# EAGLE board mainboard-01-8x2+1c (EAGLE 9.6.2), part 1 of 2
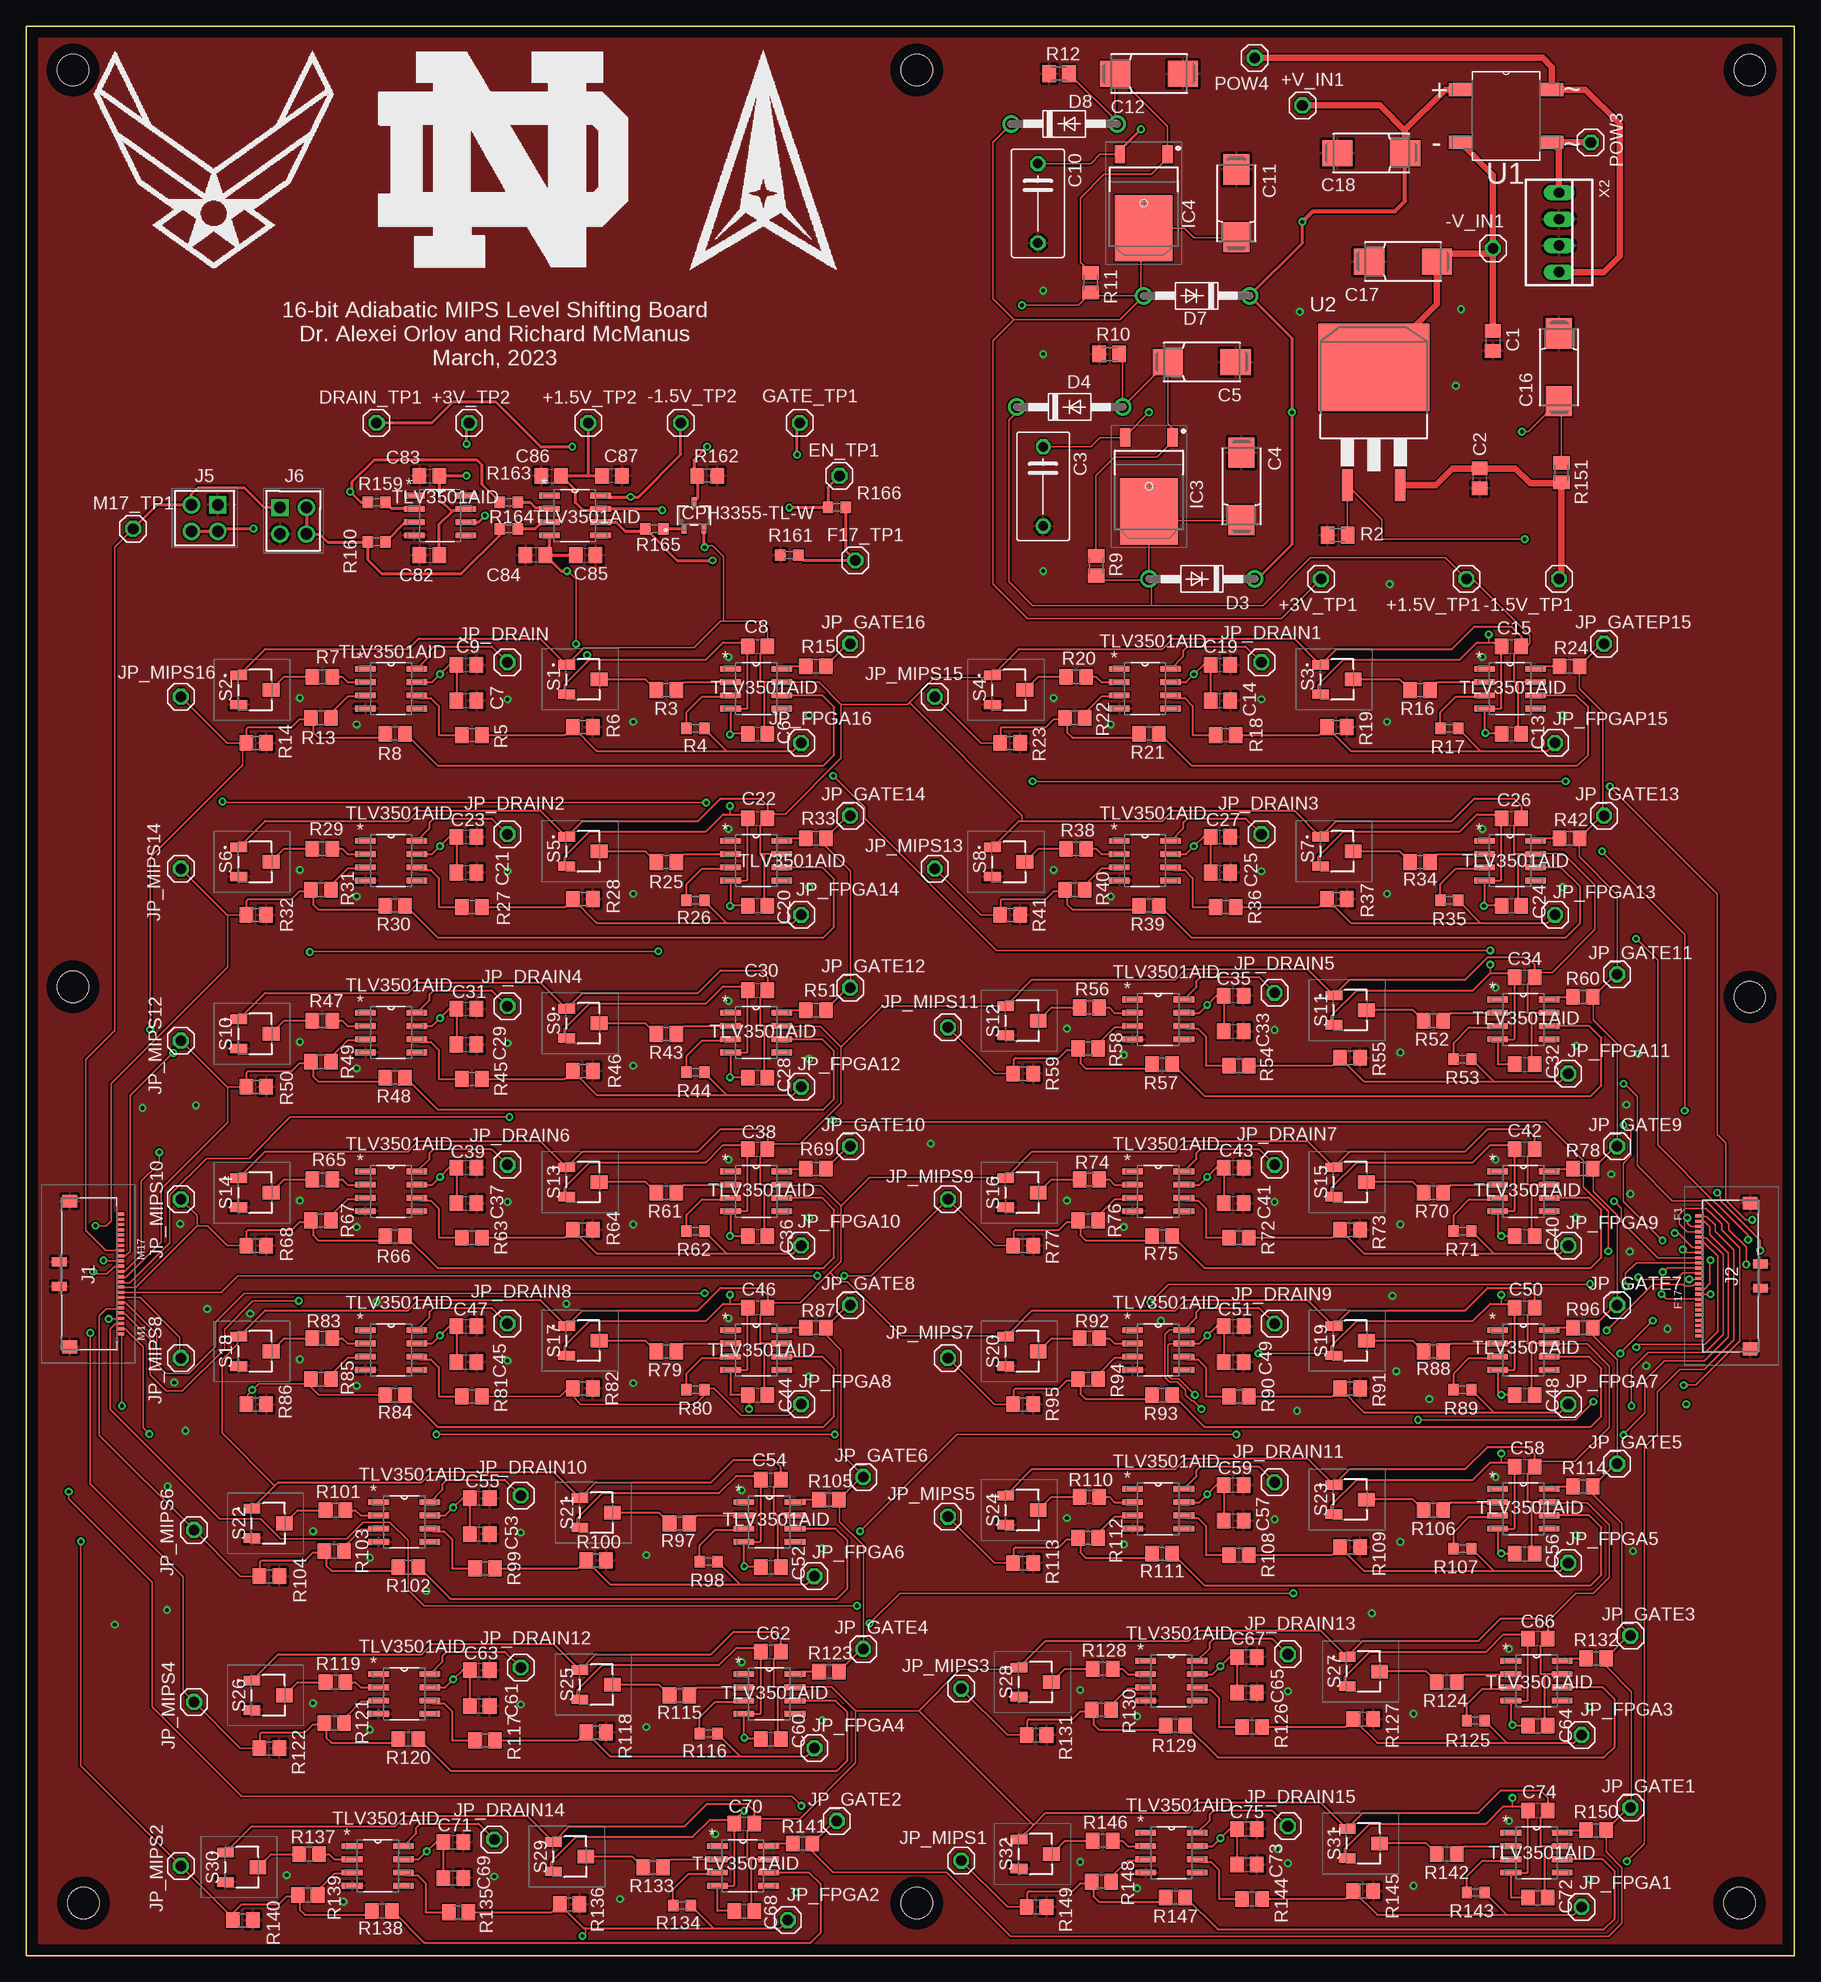
[diagram p17: board, top side]
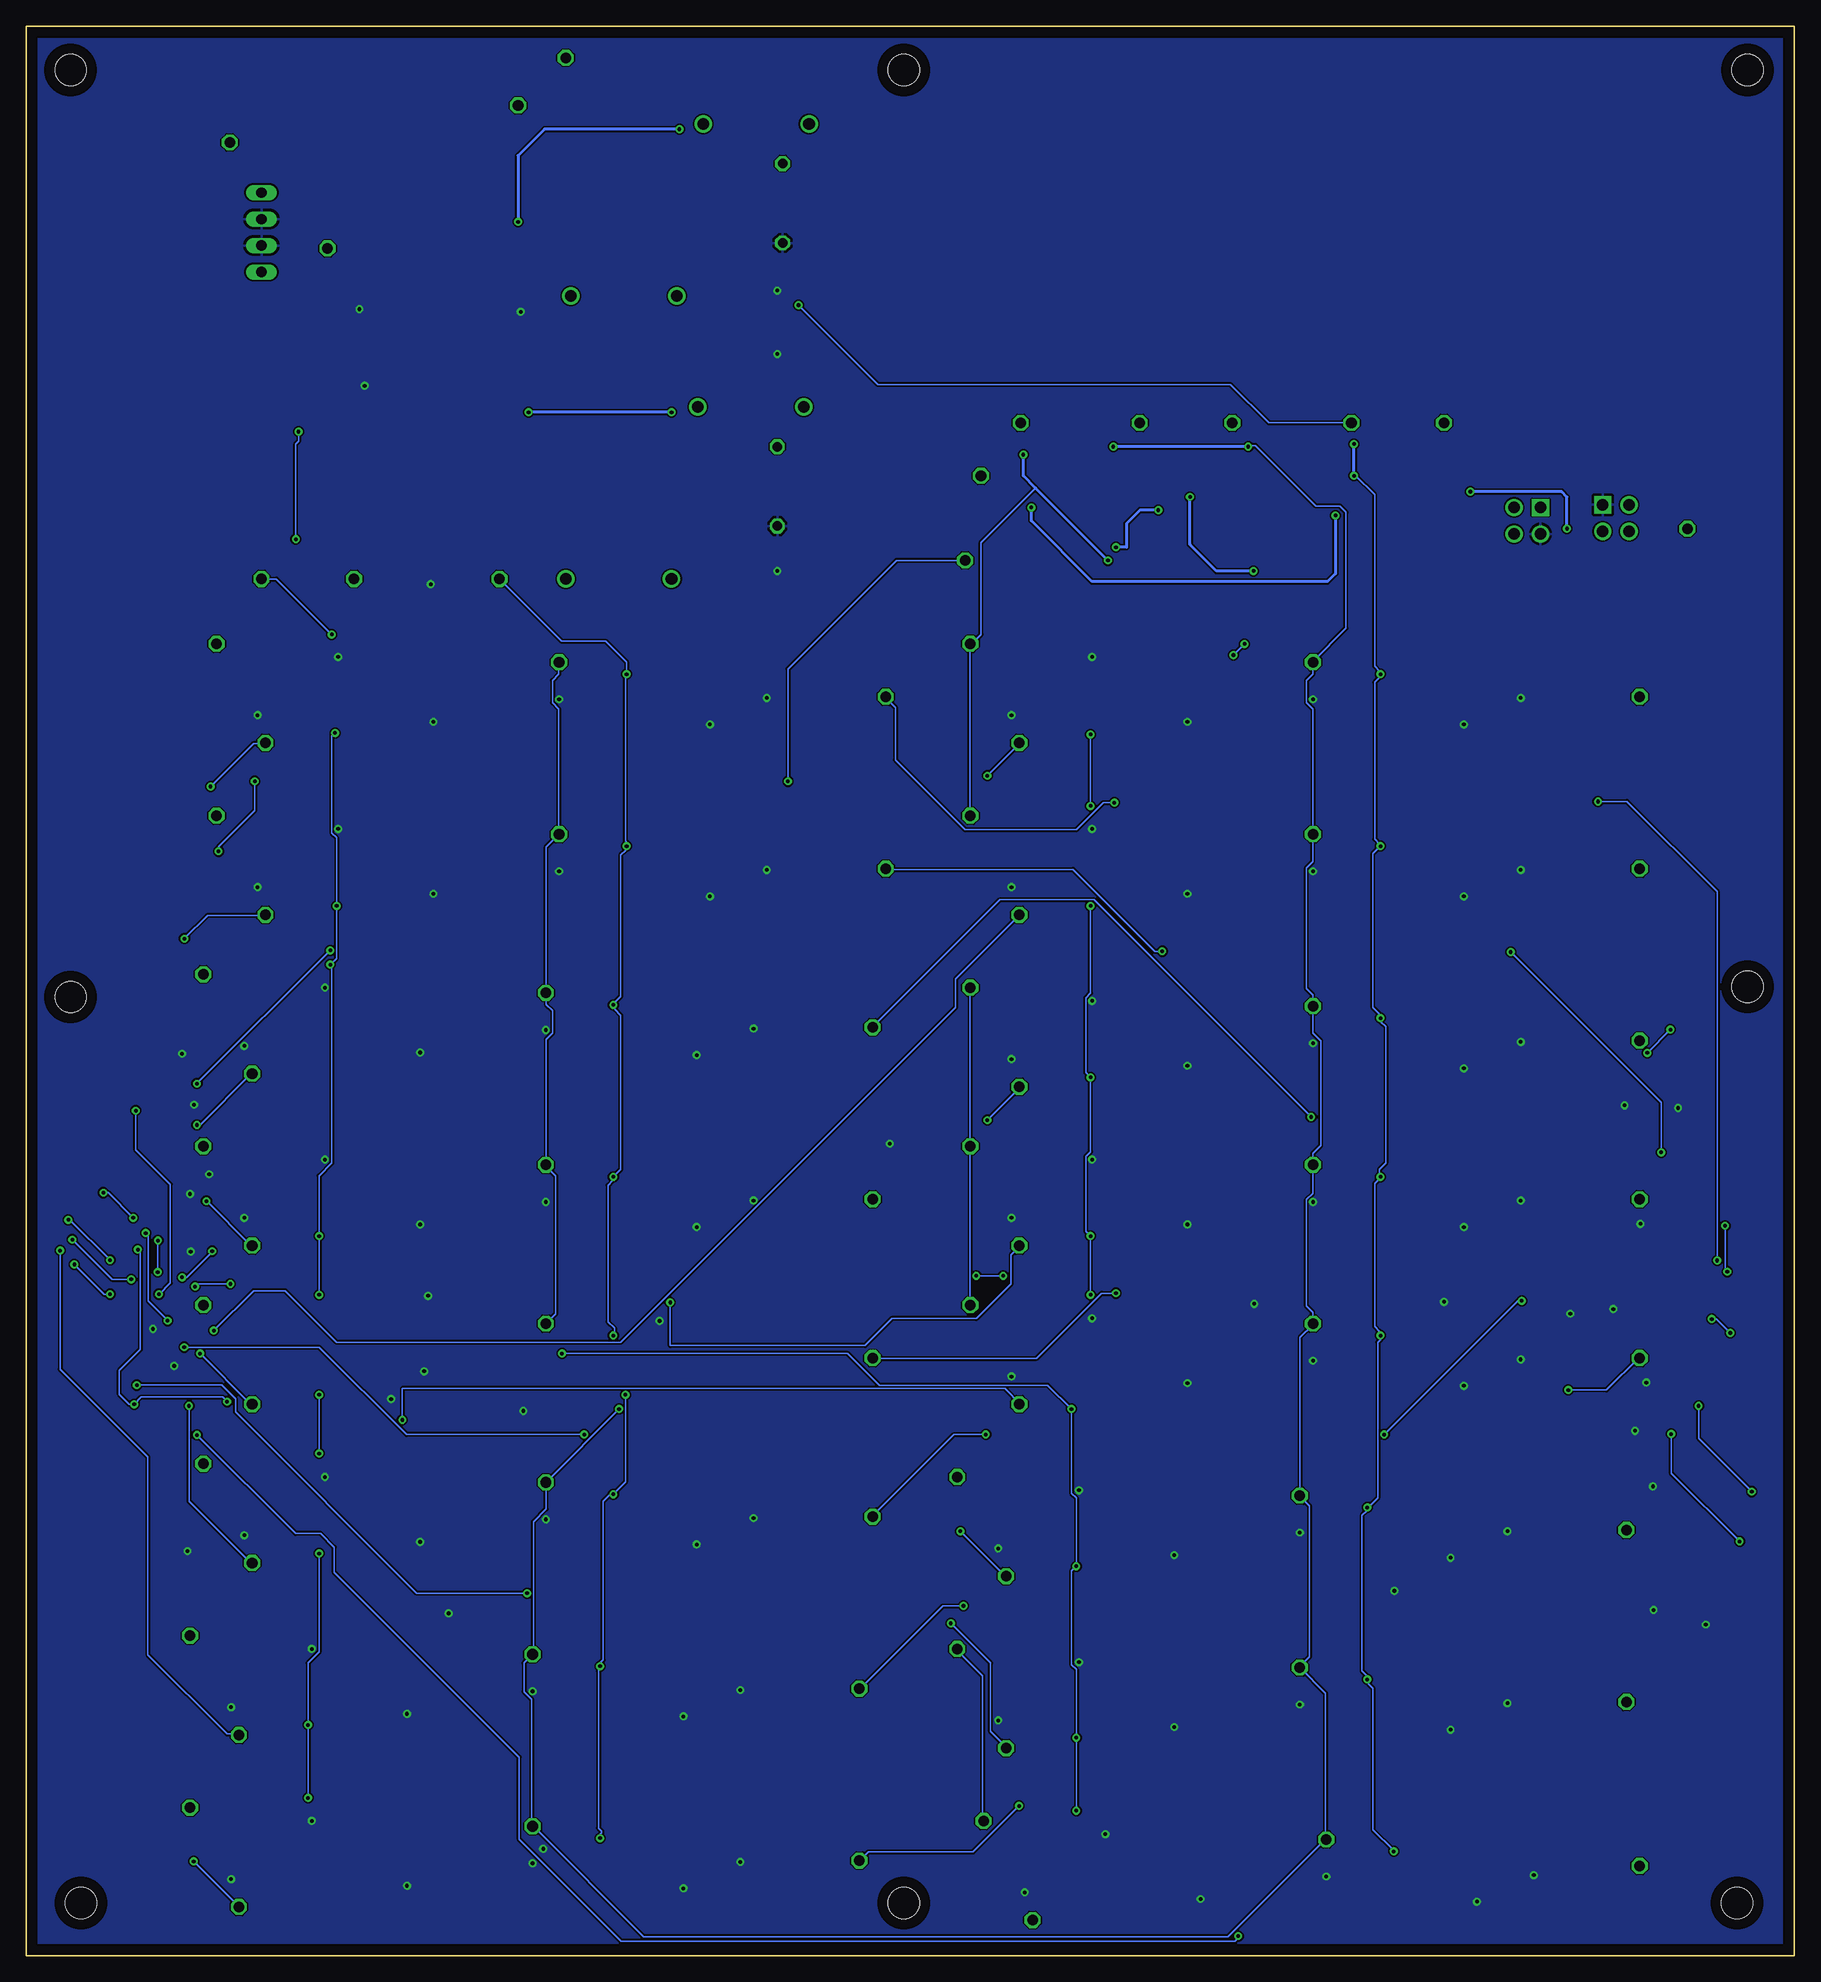
[diagram p18: board, bottom side, seen from below]

Size 169.8 x 185.29 mm. Coordinates in mm from the lower left corner, seen from the top.
Outline: 0,0 169.8,0 169.8,185.29 0,185.29 0,0
Copper layers (1*16): Top 0.035mm / dielectric 1.5mm / Bottom 0.035mm
Design rules "default *": minimum track width 6mil, minimum drill 0.35mm, track to track 6mil, track to pad 6mil, pad to pad 6mil, via to via 6mil, smd to smd 6mil, copper to edge 40mil, drill to drill 6mil, minimum pad ring 10mil, minimum via ring 8mil, stop-mask expansion 4mil, vias tented up to drill 15mil, thermal gap 10mil
Holes 3 mm at 165.51,181.06 4.52,181.06 164.51,5.06 5.52,5.06 85.52,181.06 85.52,5.06 165.51,92.06 4.52,93.06

## Footprints (pad centres in the part's own frame; a part is rotated, then mirrored left to right if it is on the bottom)
1X01 = drill 1.016 octagon: 1 0,0
C0805 = smd 1.3 x 1.5: 1 -0.95,0; 2 0.95,0
C075-052X106 = drill 0.914 octagon: 1 -3.81,0; 2 3.81,0
085CS_1AR = smd 2.9 x 2.5: + 3.25,0; - -3.25,0
DO41-10 = drill 1.118: A 5.08,0; C -5.08,0
TO228P991X238-3N = smd 1.75 x 1: 1 -4.7,2.285; 3 -4.7,-2.285 | smd 6.35 x 5.55: 4 2.4,0
5022442430 = smd 0.3 x 0.8: 1 5.75,3.08; 2 5.25,3.08; 3 4.75,3.08; 4 4.25,3.08; 5 3.75,3.08; 6 3.25,3.08; 7 2.75,3.08; 8 2.25,3.08; 9 1.75,3.08; 10 1.25,3.08; 11 0.75,3.08; 12 0.25,3.08; 13 -0.25,3.08; 14 -0.75,3.08; 15 -1.25,3.08; 16 -1.75,3.08; 17 -2.25,3.08; 18 -2.75,3.08; 19 -3.25,3.08; 20 -3.75,3.08; 21 -4.25,3.08; 22 -4.75,3.08; 23 -5.25,3.08; 24 -5.75,3.08 | smd 1.22 x 1.4: 25 -6.99,-1.77; 28 6.99,-1.77 | smd 0.85 x 1.4: 26 -1.175,-2.78; 27 1.175,-2.78
HDRV4W64P254_2X2_521X508X851P = drill 1.1 pad 1.65 square: 1 0,0 | drill 1.1 pad 1.65: 2 0,2.54; 3 2.54,0; 4 2.54,2.54
M0805 = smd 1.3 x 1.6: 1 -0.95,0; 2 0.95,0
R0805 = smd 1.3 x 1.5: 1 -0.95,0; 2 0.95,0
R0603 = smd 1 x 1.1: 1 -0.85,0; 2 0.85,0
SM3TW102 = smd 0.9 x 1.6: 1 -1.4,-1.56; 3 1.4,-1.56 | smd 1.3 x 1.6: 2 0,1.56
SOT508P985X260-4N = smd 2.235 x 1.245: 1 -4.394,2.54; 2 -4.394,-2.54; 3 4.394,-2.54; 4 4.394,2.54
D2PAK-3 = smd 1.016 x 3.05: 1 -2.54,-11.31; 3 2.54,-11.31 | smd 10.66 x 8.38: 4 0,0
D8 = smd 1.981 x 0.559: 1 -2.464,1.905; 2 -2.464,0.635; 3 -2.464,-0.635; 4 -2.464,-1.905; 5 2.464,-1.905; 6 2.464,-0.635; 7 2.464,0.635; 8 2.464,1.905
CPH3_2P9X1P6_ONS = smd 0.457 x 0.914: 1 -0.95,-1.295; 2 0.95,-1.295; 3 0,1.295
22-23-2041 = drill 1 long: 1 -3.81,0; 2 -1.27,0; 3 1.27,0; 4 3.81,0

## Placement (x,y rotation side)
+1.5V_TP1  [1X01]  138.3,132.21 180 top
+1.5V_TP2  [1X01]  53.97,147.19 0 top
+3V_TP1  [1X01]  124.33,132.21 180 top
+3V_TP2  [1X01]  42.55,147.19 0 top
+V_IN1  [1X01]  122.55,177.67 180 top
-1.5V_TP1  [1X01]  147.19,132.21 180 top
-1.5V_TP2  [1X01]  62.86,147.19 0 top
-V_IN1  [1X01]  140.84,163.96 180 top
C1  10uF  [C0805]  140.84,155.07 270 top
C2  0.1uF  [C0805]  139.57,141.86 270 top
C3  0.1uF  [C075-052X106]  97.66,141.1 270 top
C4  1uF  [085CS_1AR]  116.71,141.1 270 top
C5  10uF  [085CS_1AR]  112.9,153.03 180 top
C6  0.1uF  [C0805]  70.23,117.35 0 top
C7  0.1uF  [C0805]  42.29,120.52 0 top
C8  2.2uF  [C0805]  70.23,125.73 0 top
C9  2.2uF  [C0805]  42.29,123.95 0 top
C10  0.1uF  [C075-052X106]  97.15,168.28 270 top
C11  1uF  [085CS_1AR]  116.2,168.28 270 top
C12  10uF  [085CS_1AR]  107.82,180.72 180 top
C13  0.1uF  [C0805]  142.62,117.35 0 top
C14  0.1uF  [C0805]  114.68,120.52 0 top
C15  2.2uF  [C0805]  142.62,125.73 0 top
C16  1uF  [085CS_1AR]  147.19,152.53 90 top
C17  10uF  [085CS_1AR]  132.21,162.69 180 top
C18  10uF  [085CS_1AR]  129.16,173.1 0 top
C19  2.2uF  [C0805]  114.68,123.95 0 top
C20  0.1uF  [C0805]  70.23,100.84 0 top
C21  0.1uF  [C0805]  42.29,104.01 0 top
C22  2.2uF  [C0805]  70.23,109.22 0 top
C23  2.2uF  [C0805]  42.29,107.44 0 top
C24  0.1uF  [C0805]  142.62,100.84 0 top
C25  0.1uF  [C0805]  114.68,104.01 0 top
C26  2.2uF  [C0805]  142.62,109.22 0 top
C27  2.2uF  [C0805]  114.68,107.44 0 top
C28  0.1uF  [C0805]  70.23,84.33 0 top
C29  0.1uF  [C0805]  42.29,87.5 0 top
C30  2.2uF  [C0805]  70.23,92.71 0 top
C31  2.2uF  [C0805]  42.29,90.93 0 top
C32  0.1uF  [C0805]  143.89,85.6 0 top
C33  0.1uF  [C0805]  115.95,88.77 0 top
C34  2.2uF  [C0805]  143.89,93.98 0 top
C35  2.2uF  [C0805]  115.95,92.2 0 top
C36  0.1uF  [C0805]  70.23,69.09 0 top
C37  0.1uF  [C0805]  42.29,72.26 0 top
C38  2.2uF  [C0805]  70.23,77.47 0 top
C39  2.2uF  [C0805]  42.29,75.69 0 top
C40  0.1uF  [C0805]  143.89,69.09 0 top
C41  0.1uF  [C0805]  115.95,72.26 0 top
C42  2.2uF  [C0805]  143.89,77.47 0 top
C43  2.2uF  [C0805]  115.95,75.69 0 top
C44  0.1uF  [C0805]  70.23,53.85 0 top
C45  0.1uF  [C0805]  42.29,57.02 0 top
C46  2.2uF  [C0805]  70.23,62.23 0 top
C47  2.2uF  [C0805]  42.29,60.45 0 top
C48  0.1uF  [C0805]  143.89,53.85 0 top
C49  0.1uF  [C0805]  115.95,57.02 0 top
C50  2.2uF  [C0805]  143.89,62.23 0 top
C51  2.2uF  [C0805]  115.95,60.45 0 top
C52  0.1uF  [C0805]  71.5,37.34 0 top
C53  0.1uF  [C0805]  43.56,40.51 0 top
C54  2.2uF  [C0805]  71.5,45.72 0 top
C55  2.2uF  [C0805]  43.56,43.94 0 top
C56  0.1uF  [C0805]  143.89,38.61 0 top
C57  0.1uF  [C0805]  115.95,41.78 0 top
C58  2.2uF  [C0805]  143.89,46.99 0 top
C59  2.2uF  [C0805]  115.95,45.21 0 top
C60  0.1uF  [C0805]  71.5,20.83 0 top
C61  0.1uF  [C0805]  43.56,24 0 top
C62  2.2uF  [C0805]  71.5,29.21 0 top
C63  2.2uF  [C0805]  43.56,27.43 0 top
C64  0.1uF  [C0805]  145.16,22.1 0 top
C65  0.1uF  [C0805]  117.22,25.27 0 top
C66  2.2uF  [C0805]  145.16,30.48 0 top
C67  2.2uF  [C0805]  117.22,28.7 0 top
C68  0.1uF  [C0805]  68.96,4.32 0 top
C69  0.1uF  [C0805]  41.02,7.49 0 top
C70  2.2uF  [C0805]  68.96,12.7 0 top
C71  2.2uF  [C0805]  41.02,10.92 0 top
C72  0.1uF  [C0805]  145.16,5.59 0 top
C73  0.1uF  [C0805]  117.22,8.76 0 top
C74  2.2uF  [C0805]  145.16,13.97 0 top
C75  2.2uF  [C0805]  117.22,12.19 0 top
C82  2.2uF  [C0805]  38.73,134.49 0 top
C83  0.1uF  [C0805]  38.73,142.11 0 top
C84  0.1uF  [C0805]  48.89,134.49 180 top
C85  2.2uF  [C0805]  53.72,134.49 0 top
C86  0.1uF  [C0805]  50.42,142.11 0 top
C87  2.2uF  [C0805]  56.26,142.11 180 top
D3  1N4002  [DO41-10]  112.9,132.21 180 top
D4  1N4002  [DO41-10]  100.2,148.72 0 top
D7  1N4002  [DO41-10]  112.39,159.38 180 top
D8  1N4002  [DO41-10]  99.7,175.9 0 top
DRAIN_TP1  [1X01]  33.66,147.19 0 top
EN_TP1  [1X01]  78.11,142.11 0 top
F17_TP1  [1X01]  79.63,133.99 0 top
GATE_TP1  [1X01]  74.3,147.19 0 top
IC3  LM317AMDT_NOPB  [TO228P991X238-3N]  107.82,141.1 270 top
IC4  LM317AMDT_NOPB  [TO228P991X238-3N]  107.32,168.28 270 top
J1  5022442430  [5022442430]  5.97,65.47 270 top
J2  5022442430  [5022442430]  163.77,65.28 90 top
J5  70287-1098  [HDRV4W64P254_2X2_521X508X851P]  18.42,139.32 180 top
J6  70287-1098  [HDRV4W64P254_2X2_521X508X851P]  24.38,139.06 270 top
JP_DRAIN  [1X01]  46.23,124.21 0 top
JP_DRAIN1  [1X01]  118.62,124.21 0 top
JP_DRAIN2  [1X01]  46.23,107.7 0 top
JP_DRAIN3  [1X01]  118.62,107.7 0 top
JP_DRAIN4  [1X01]  46.23,91.19 0 top
JP_DRAIN5  [1X01]  119.89,92.46 0 top
JP_DRAIN6  [1X01]  46.23,75.95 0 top
JP_DRAIN7  [1X01]  119.89,75.95 0 top
JP_DRAIN8  [1X01]  46.23,60.71 0 top
JP_DRAIN9  [1X01]  119.89,60.71 0 top
JP_DRAIN10  [1X01]  47.5,44.2 0 top
JP_DRAIN11  [1X01]  119.89,45.47 0 top
JP_DRAIN12  [1X01]  47.5,27.69 0 top
JP_DRAIN13  [1X01]  121.16,28.96 0 top
JP_DRAIN14  [1X01]  44.96,11.18 0 top
JP_DRAIN15  [1X01]  121.16,12.45 0 top
JP_FPGA1  [1X01]  149.35,4.7 0 top
JP_FPGA2  [1X01]  73.15,3.43 0 top
JP_FPGA3  [1X01]  149.35,21.21 0 top
JP_FPGA4  [1X01]  75.69,19.94 0 top
JP_FPGA5  [1X01]  148.08,37.72 0 top
JP_FPGA6  [1X01]  75.69,36.45 0 top
JP_FPGA7  [1X01]  148.08,52.96 0 top
JP_FPGA8  [1X01]  74.42,52.96 0 top
JP_FPGA9  [1X01]  148.08,68.2 0 top
JP_FPGA10  [1X01]  74.42,68.2 0 top
JP_FPGA11  [1X01]  148.08,84.71 0 top
JP_FPGA12  [1X01]  74.42,83.44 0 top
JP_FPGA13  [1X01]  146.81,99.95 0 top
JP_FPGA14  [1X01]  74.42,99.95 0 top
JP_FPGA16  [1X01]  74.42,116.46 0 top
JP_FPGAP15  [1X01]  146.81,116.46 0 top
JP_GATE1  [1X01]  154.05,14.22 0 top
JP_GATE2  [1X01]  77.85,12.95 0 top
JP_GATE3  [1X01]  154.05,30.73 0 top
JP_GATE4  [1X01]  80.39,29.46 0 top
JP_GATE5  [1X01]  152.78,47.24 0 top
JP_GATE6  [1X01]  80.39,45.97 0 top
JP_GATE7  [1X01]  152.78,62.48 0 top
JP_GATE8  [1X01]  79.12,62.48 0 top
JP_GATE9  [1X01]  152.78,77.72 0 top
JP_GATE10  [1X01]  79.12,77.72 0 top
JP_GATE11  [1X01]  152.78,94.23 0 top
JP_GATE12  [1X01]  79.12,92.96 0 top
JP_GATE13  [1X01]  151.51,109.47 0 top
JP_GATE14  [1X01]  79.12,109.47 0 top
JP_GATE16  [1X01]  79.12,125.98 0 top
JP_GATEP15  [1X01]  151.51,125.98 0 top
JP_MIPS1  [1X01]  89.79,9.14 0 top
JP_MIPS2  [1X01]  14.86,8.64 0 top
JP_MIPS3  [1X01]  89.79,25.65 0 top
JP_MIPS4  [1X01]  16.13,24.38 0 top
JP_MIPS5  [1X01]  88.52,42.16 0 top
JP_MIPS6  [1X01]  16.13,40.89 0 top
JP_MIPS7  [1X01]  88.52,57.4 0 top
JP_MIPS8  [1X01]  14.86,57.4 0 top
JP_MIPS9  [1X01]  88.52,72.64 0 top
JP_MIPS10  [1X01]  14.86,72.64 0 top
JP_MIPS11  [1X01]  88.52,89.15 0 top
JP_MIPS12  [1X01]  14.86,87.88 0 top
JP_MIPS13  [1X01]  87.25,104.39 0 top
JP_MIPS14  [1X01]  14.86,104.39 0 top
JP_MIPS15  [1X01]  87.25,120.9 0 top
JP_MIPS16  [1X01]  14.86,120.9 0 top
M17_TP1  [1X01]  10.29,137.03 0 top
POW3  [1X01]  150.24,174.12 180 top
POW4  [1X01]  117.98,182.25 180 top
R2  49Ω  [M0805]  125.92,136.41 0 top
R3  130  [R0805]  61.47,121.54 180 top
R4  130  [R0603]  64.26,117.86 180 top
R5  220  [R0805]  42.8,117.22 0 top
R6  220  [R0805]  53.47,117.98 0 top
R7  130  [R0805]  28.45,122.81 0 top
R8  220  [R0805]  35.43,117.35 180 top
R9  240Ω  [M0805]  102.74,133.48 270 top
R10  49Ω  [M0805]  104.01,153.8 0 top
R11  240Ω  [M0805]  102.23,160.66 270 top
R12  390Ω  [M0805]  99.19,180.72 0 top
R13  130  [R0805]  28.32,118.87 0 top
R14  220  [R0805]  22.1,116.46 0 top
R15  220  [R0805]  75.82,123.83 0 top
R16  130  [R0805]  133.86,121.54 180 top
R17  130  [R0603]  136.65,117.86 180 top
R18  220  [R0805]  115.19,117.22 0 top
R19  220  [R0805]  125.86,117.98 0 top
R20  130  [R0805]  100.84,122.81 0 top
R21  220  [R0805]  107.82,117.35 180 top
R22  130  [R0805]  100.71,118.87 0 top
R23  220  [R0805]  94.49,116.46 0 top
R24  220  [R0805]  148.21,123.83 0 top
R25  130  [R0805]  61.47,105.03 180 top
R26  130  [R0603]  64.26,101.35 180 top
R27  220  [R0805]  42.8,100.71 0 top
R28  220  [R0805]  53.47,101.47 0 top
R29  130  [R0805]  28.45,106.3 0 top
R30  220  [R0805]  35.43,100.84 180 top
R31  130  [R0805]  28.32,102.36 0 top
R32  220  [R0805]  22.1,99.95 0 top
R33  220  [R0805]  75.82,107.31 0 top
R34  130  [R0805]  133.86,105.03 180 top
R35  130  [R0603]  136.65,101.35 180 top
R36  220  [R0805]  115.19,100.71 0 top
R37  220  [R0805]  125.86,101.47 0 top
R38  130  [R0805]  100.84,106.3 0 top
R39  220  [R0805]  107.82,100.84 180 top
R40  130  [R0805]  100.71,102.36 0 top
R41  220  [R0805]  94.49,99.95 0 top
R42  220  [R0805]  148.21,107.31 0 top
R43  130  [R0805]  61.47,88.52 180 top
R44  130  [R0603]  64.26,84.84 180 top
R45  220  [R0805]  42.8,84.2 0 top
R46  220  [R0805]  53.47,84.96 0 top
R47  130  [R0805]  28.45,89.79 0 top
R48  220  [R0805]  35.43,84.33 180 top
R49  130  [R0805]  28.32,85.85 0 top
R50  220  [R0805]  22.1,83.44 0 top
R51  220  [R0805]  75.82,90.81 0 top
R52  130  [R0805]  135.13,89.79 180 top
R53  130  [R0603]  137.92,86.11 180 top
R54  220  [R0805]  116.46,85.47 0 top
R55  220  [R0805]  127.13,86.23 0 top
R56  130  [R0805]  102.11,91.06 0 top
R57  220  [R0805]  109.09,85.6 180 top
R58  130  [R0805]  101.98,87.12 0 top
R59  220  [R0805]  95.76,84.71 0 top
R60  220  [R0805]  149.48,92.08 0 top
R61  130  [R0805]  61.47,73.28 180 top
R62  130  [R0603]  64.26,69.6 180 top
R63  220  [R0805]  42.8,68.96 0 top
R64  220  [R0805]  53.47,69.72 0 top
R65  130  [R0805]  28.45,74.55 0 top
R66  220  [R0805]  35.43,69.09 180 top
R67  130  [R0805]  28.32,70.61 0 top
R68  220  [R0805]  22.1,68.2 0 top
R69  220  [R0805]  75.82,75.56 0 top
R70  130  [R0805]  135.13,73.28 180 top
R71  130  [R0603]  137.92,69.6 180 top
R72  220  [R0805]  116.46,68.96 0 top
R73  220  [R0805]  127.13,69.72 0 top
R74  130  [R0805]  102.11,74.55 0 top
R75  220  [R0805]  109.09,69.09 180 top
R76  130  [R0805]  101.98,70.61 0 top
R77  220  [R0805]  95.76,68.2 0 top
R78  220  [R0805]  149.48,75.56 0 top
R79  130  [R0805]  61.47,58.04 180 top
R80  130  [R0603]  64.26,54.36 180 top
R81  220  [R0805]  42.8,53.72 0 top
R82  220  [R0805]  53.47,54.48 0 top
R83  130  [R0805]  28.45,59.31 0 top
R84  220  [R0805]  35.43,53.85 180 top
R85  130  [R0805]  28.32,55.37 0 top
R86  220  [R0805]  22.1,52.96 0 top
R87  220  [R0805]  75.82,60.33 0 top
R88  130  [R0805]  135.13,58.04 180 top
R89  130  [R0603]  137.92,54.36 180 top
R90  220  [R0805]  116.46,53.72 0 top
R91  220  [R0805]  127.13,54.48 0 top
R92  130  [R0805]  102.11,59.31 0 top
R93  220  [R0805]  109.09,53.85 180 top
R94  130  [R0805]  101.98,55.37 0 top
R95  220  [R0805]  95.76,52.96 0 top
R96  220  [R0805]  149.48,60.33 0 top
R97  130  [R0805]  62.74,41.53 180 top
R98  130  [R0603]  65.53,37.85 180 top
R99  220  [R0805]  44.07,37.21 0 top
R100  220  [R0805]  54.74,37.97 0 top
R101  130  [R0805]  29.72,42.8 0 top
R102  220  [R0805]  36.7,37.34 180 top
R103  130  [R0805]  29.59,38.86 0 top
R104  220  [R0805]  23.37,36.45 0 top
R105  220  [R0805]  77.09,43.81 0 top
R106  130  [R0805]  135.13,42.8 180 top
R107  130  [R0603]  137.92,39.12 180 top
R108  220  [R0805]  116.46,38.48 0 top
R109  220  [R0805]  127.13,39.24 0 top
R110  130  [R0805]  102.11,44.07 0 top
R111  220  [R0805]  109.09,38.61 180 top
R112  130  [R0805]  101.98,40.13 0 top
R113  220  [R0805]  95.76,37.72 0 top
R114  220  [R0805]  149.48,45.09 0 top
R115  130  [R0805]  62.74,25.02 180 top
R116  130  [R0603]  65.53,21.34 180 top
R117  220  [R0805]  44.07,20.7 0 top
R118  220  [R0805]  54.74,21.46 0 top
R119  130  [R0805]  29.72,26.29 0 top
R120  220  [R0805]  36.7,20.83 180 top
R121  130  [R0805]  29.59,22.35 0 top
R122  220  [R0805]  23.37,19.94 0 top
R123  220  [R0805]  77.09,27.31 0 top
R124  130  [R0805]  136.4,26.29 180 top
R125  130  [R0603]  139.19,22.61 180 top
R126  220  [R0805]  117.73,21.97 0 top
R127  220  [R0805]  128.4,22.73 0 top
R128  130  [R0805]  103.38,27.56 0 top
R129  220  [R0805]  110.36,22.1 180 top
R130  130  [R0805]  103.25,23.62 0 top
R131  220  [R0805]  97.03,21.21 0 top
R132  220  [R0805]  150.75,28.58 0 top
R133  130  [R0805]  60.2,8.51 180 top
R134  130  [R0603]  62.99,4.83 180 top
R135  220  [R0805]  41.53,4.19 0 top
R136  220  [R0805]  52.2,4.95 0 top
R137  130  [R0805]  27.18,9.78 0 top
R138  220  [R0805]  34.16,4.32 180 top
R139  130  [R0805]  27.05,5.84 0 top
R140  220  [R0805]  20.83,3.43 0 top
R141  220  [R0805]  74.55,10.8 0 top
R142  130  [R0805]  136.4,9.78 180 top
R143  130  [R0603]  139.19,6.1 180 top
R144  220  [R0805]  117.73,5.46 0 top
R145  220  [R0805]  128.4,6.22 0 top
R146  130  [R0805]  103.38,11.05 0 top
R147  220  [R0805]  110.36,5.59 180 top
R148  130  [R0805]  103.25,7.11 0 top
R149  220  [R0805]  97.03,4.7 0 top
R150  220  [R0805]  150.75,12.06 0 top
R151  240Ω  [M0805]  147.42,142.41 270 top
R159  220  [R0603]  33.66,139.57 0 top
R160  220  [R0603]  33.66,135.76 0 top
R161  220  [R0603]  73.28,134.49 0 top
R162  51  [R0805]  65.4,142.11 0 top
R163  220  [R0603]  46.36,139.57 0 top
R164  220  [R0603]  46.36,137.03 0 top
R165  220  [R0603]  60.33,137.03 0 top
R166  220  [R0603]  77.85,139.06 0 top
S1  SM-3TW102  [SM3TW102]  53.47,122.56 270 top
S2  SM-3TW102  [SM3TW102]  21.97,121.54 270 top
S3  SM-3TW102  [SM3TW102]  125.86,122.56 270 top
S4  SM-3TW102  [SM3TW102]  94.36,121.54 270 top
S5  SM-3TW102  [SM3TW102]  53.47,106.05 270 top
S6  SM-3TW102  [SM3TW102]  21.97,105.03 270 top
S7  SM-3TW102  [SM3TW102]  125.86,106.05 270 top
S8  SM-3TW102  [SM3TW102]  94.36,105.03 270 top
S9  SM-3TW102  [SM3TW102]  53.47,89.53 270 top
S10  SM-3TW102  [SM3TW102]  21.97,88.52 270 top
S11  SM-3TW102  [SM3TW102]  127.13,90.81 270 top
S12  SM-3TW102  [SM3TW102]  95.63,89.79 270 top
S13  SM-3TW102  [SM3TW102]  53.47,74.3 270 top
S14  SM-3TW102  [SM3TW102]  21.97,73.28 270 top
S15  SM-3TW102  [SM3TW102]  127.13,74.3 270 top
S16  SM-3TW102  [SM3TW102]  95.63,73.28 270 top
S17  SM-3TW102  [SM3TW102]  53.47,59.06 270 top
S18  SM-3TW102  [SM3TW102]  21.97,58.04 270 top
S19  SM-3TW102  [SM3TW102]  127.13,59.06 270 top
S20  SM-3TW102  [SM3TW102]  95.63,58.04 270 top
S21  SM-3TW102  [SM3TW102]  54.74,42.55 270 top
S22  SM-3TW102  [SM3TW102]  23.24,41.53 270 top
S23  SM-3TW102  [SM3TW102]  127.13,43.81 270 top
S24  SM-3TW102  [SM3TW102]  95.63,42.8 270 top
S25  SM-3TW102  [SM3TW102]  54.74,26.03 270 top
S26  SM-3TW102  [SM3TW102]  23.24,25.02 270 top
S27  SM-3TW102  [SM3TW102]  128.4,27.31 270 top
S28  SM-3TW102  [SM3TW102]  96.9,26.29 270 top
S29  SM-3TW102  [SM3TW102]  52.2,9.53 270 top
S30  SM-3TW102  [SM3TW102]  20.7,8.51 270 top
S31  SM-3TW102  [SM3TW102]  128.4,10.8 270 top
S32  SM-3TW102  [SM3TW102]  96.9,9.78 270 top
U1  DF10S  [SOT508P985X260-4N]  142.11,176.66 0 top
U2  MC79GENERICD2T  [D2PAK-3]  129.41,152.53 0 top
U3  TLV3501AID  [D8]  70.1,121.67 0 top
U4  TLV3501AID  [D8]  35.05,121.67 0 top
U5  TLV3501AID  [D8]  142.49,121.67 0 top
U6  TLV3501AID  [D8]  107.44,121.67 0 top
U7  TLV3501AID  [D8]  70.1,105.16 0 top
U8  TLV3501AID  [D8]  35.05,105.16 0 top
U9  TLV3501AID  [D8]  142.49,105.16 0 top
U10  TLV3501AID  [D8]  107.44,105.16 0 top
U11  TLV3501AID  [D8]  70.1,88.65 0 top
U12  TLV3501AID  [D8]  35.05,88.65 0 top
U13  TLV3501AID  [D8]  143.76,89.92 0 top
U14  TLV3501AID  [D8]  108.71,89.92 0 top
U15  TLV3501AID  [D8]  70.1,73.41 0 top
U16  TLV3501AID  [D8]  35.05,73.41 0 top
U17  TLV3501AID  [D8]  143.76,73.41 0 top
U18  TLV3501AID  [D8]  108.71,73.41 0 top
U19  TLV3501AID  [D8]  70.1,58.17 0 top
U20  TLV3501AID  [D8]  35.05,58.17 0 top
U21  TLV3501AID  [D8]  143.76,58.17 0 top
U22  TLV3501AID  [D8]  108.71,58.17 0 top
U23  TLV3501AID  [D8]  71.37,41.66 0 top
U24  TLV3501AID  [D8]  36.32,41.66 0 top
U25  TLV3501AID  [D8]  143.76,42.93 0 top
U26  TLV3501AID  [D8]  108.71,42.93 0 top
U27  TLV3501AID  [D8]  71.37,25.15 0 top
U28  TLV3501AID  [D8]  36.32,25.15 0 top
U29  TLV3501AID  [D8]  145.03,26.42 0 top
U30  TLV3501AID  [D8]  109.98,26.42 0 top
U31  TLV3501AID  [D8]  68.83,8.64 0 top
U32  TLV3501AID  [D8]  33.78,8.64 0 top
U33  TLV3501AID  [D8]  145.03,9.91 0 top
U34  TLV3501AID  [D8]  109.98,9.91 0 top
U38  CPH3355-TL-W  [CPH3_2P9X1P6_ONS]  64.14,138.3 0 top
U39  TLV3501AID  [D8]  39.75,138.3 0 top
U40  TLV3501AID  [D8]  52.7,138.3 0 top
X2  22-23-2041  [22-23-2041]  147.19,165.48 270 top